# Altium schematic sheet nrf_ha_sensor_Particles.SchDoc: PCA20020 - Power Supply
size A4; Organization: Nordic Semiconductor; DocumentNumber: 8; SheetNumber: 8; SheetTotal: 9; CompanyName: Nordic Semiconductor; DocumentSize: A4
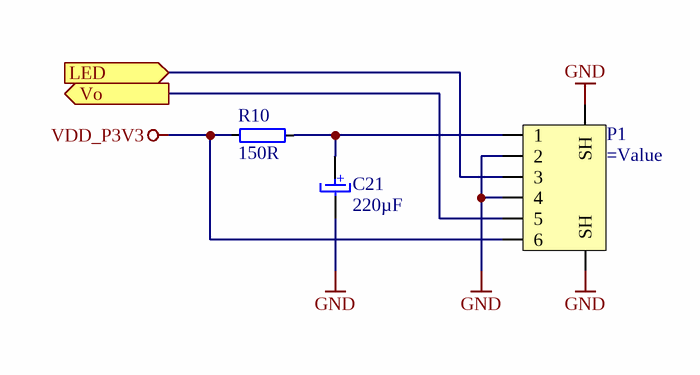
[diagram p0: nrf_ha_sensor_Particles.SchDoc]

## Parts
C21  220µF  [CAPPR200-500X1100]
P1  (no value)  [S6B-ZR-SM4A-TF]
R10  150R  [RESC1005X04L]

## Ports
LED (in), Vo (out)

## Nets
GND: C21.1(NEG) P1.2 P1.4 P1.SH1(SH) P1.SH2(SH)
VDD_P3V3: P1.6 R10.1
LED: P1.3 ; port LED
Vo: P1.5 ; port Vo
NetC21_2: C21.2(POS) P1.1 R10.2

## Notes on the sheet
- Title
- Size
- Date:
- A4
- Project Number
- Sheet         of
- Revision
- File:
- Drawn By:
- (in symbol Cap-Electrolyt-47µF/25V) +

## Library data of the parts
C21 = Cap-Electrolyt-47µF/25V: Capacitor, Radial Aluminum Electrolytic, ±20%; Manufacturer: Multicomp; Manufacturer Part Number: MCGPR25V476M5X11; Note: 25V; Artikkelnr Noca: N.A.; Part Number: Cap-Electrolyt-47µF/25V; ComponentLink1URL: *; ComponentLink1Description: Datasheet; ComponentLink2URL: *; ComponentLink2Description: Supplier link; HelpURL: http://www.farnell.com/datasheets/1571287.pdf; Footprint Doc: CAPPR200-500X1100; LatestRevisionDate: 2013-06-05; Pin Count: 2; Publisher: Nordic Semiconductor; Published: 2009-10-09; Value: 220µF; Supplier 1: Farnell; Supplier Part Number 1: 945-1170; Supplier 2: *; Supplier Part Number 2: *; Part number IPS: N.A.
P1 = S6B-ZR-SM4A-TF
R10 = R0402-150: Resistor, ±1%, 0.063W; Part number IPS: N.A.; Note: Chip Res 1%; Artikkelnr Noca: 27049053; Part Number: R0402-150; Manufacturer: *; Manufacturer Part Number: *; ComponentLink1URL: *; ComponentLink1Description: Datasheet; ComponentLink2URL: *; ComponentLink2Description: Supplier link; HelpURL: *; Footprint Doc: 0402; LatestRevisionDate: 2009-11-23; Pin Count: 2; Publisher: Nordic Semiconductor; Published: 2009-05-08; Value: 150R; Supplier 1: Farnell; Supplier Part Number 1: 173-8839; Supplier 2: *; Supplier Part Number 2: *